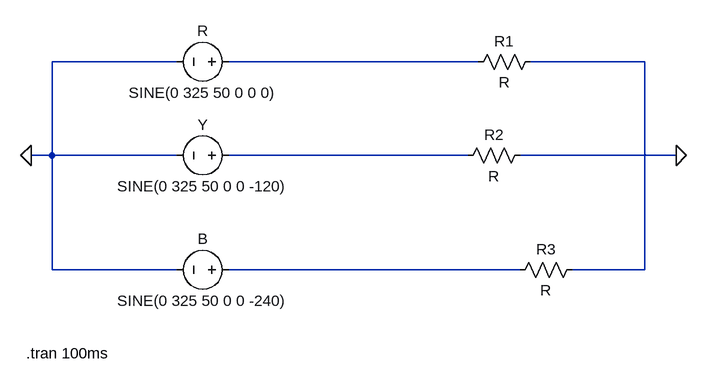
[diagram p0: schematic 3phase 3.asc]
3phase 3.asc, the LTspice schematic file:
Version 4
SHEET 1 880 680
WIRE -208 112 -400 112
WIRE 256 112 -128 112
WIRE 512 112 336 112
WIRE -400 256 -400 112
WIRE -400 256 -432 256
WIRE -208 256 -400 256
WIRE 240 256 -128 256
WIRE 560 256 320 256
WIRE -400 432 -400 256
WIRE -208 432 -400 432
WIRE 320 432 -128 432
WIRE 512 432 512 112
WIRE 512 432 400 432
FLAG -432 256 0
FLAG 560 256 0
SYMBOL voltage -112 112 R90
WINDOW 0 -32 56 VBottom 2
WINDOW 3 32 56 VTop 2
WINDOW 123 0 0 Left 0
WINDOW 39 0 0 Left 0
SYMATTR InstName R
SYMATTR Value SINE(0 325 50 0 0 0)
SYMBOL voltage -112 256 R90
WINDOW 0 -32 56 VBottom 2
WINDOW 3 32 56 VTop 2
WINDOW 123 0 0 Left 0
WINDOW 39 0 0 Left 0
SYMATTR InstName Y
SYMATTR Value SINE(0 325 50 0 0 -120)
SYMBOL voltage -112 432 R90
WINDOW 0 -32 56 VBottom 2
WINDOW 3 32 56 VTop 2
WINDOW 123 0 0 Left 0
WINDOW 39 0 0 Left 0
SYMATTR InstName B
SYMATTR Value SINE(0 325 50 0 0 -240)
SYMBOL res 352 96 R90
WINDOW 0 0 56 VBottom 2
WINDOW 3 32 56 VTop 2
SYMATTR InstName R1
SYMBOL res 336 240 R90
WINDOW 0 0 56 VBottom 2
WINDOW 3 32 56 VTop 2
SYMATTR InstName R2
SYMBOL res 416 416 R90
WINDOW 0 0 56 VBottom 2
WINDOW 3 32 56 VTop 2
SYMATTR InstName R3
TEXT -440 560 Left 2 !.tran 100ms

The netlist it stands for:
* 3phase 3.asc
V§R N001 0 SINE(0 325 50 0 0 0)
V§Y N003 0 SINE(0 325 50 0 0 -120)
V§B N004 0 SINE(0 325 50 0 0 -240)
R1 N002 N001 R
R2 0 N003 R
R3 N002 N004 R
.tran 100ms
.backanno
.end